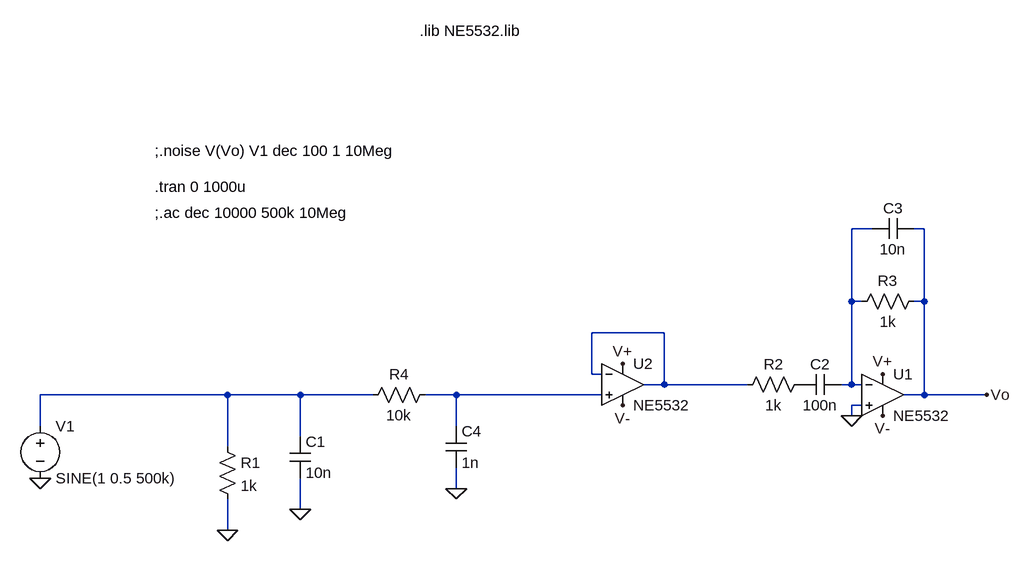
[diagram p0: schematic Draft1.asc]
Draft1.asc, the LTspice schematic file:
Version 4
SHEET 1 1004 680
WIRE 784 96 752 96
WIRE 864 96 848 96
WIRE 752 208 752 96
WIRE 768 208 752 208
WIRE 864 208 864 96
WIRE 864 208 848 208
WIRE 464 256 352 256
WIRE 352 320 352 256
WIRE 368 320 352 320
WIRE 464 336 464 256
WIRE 464 336 432 336
WIRE 592 336 464 336
WIRE 752 336 752 208
WIRE 752 336 736 336
WIRE 768 336 752 336
WIRE -208 352 -496 352
WIRE -96 352 -208 352
WIRE 16 352 -96 352
WIRE 144 352 96 352
WIRE 368 352 144 352
WIRE 864 352 864 208
WIRE 864 352 832 352
WIRE 960 352 864 352
WIRE 768 368 752 368
WIRE 752 384 752 368
WIRE -496 400 -496 352
WIRE 144 400 144 352
WIRE -96 416 -96 352
WIRE -208 432 -208 352
WIRE 144 496 144 464
WIRE -96 528 -96 480
WIRE -208 560 -208 512
FLAG -208 560 0
FLAG -96 528 0
FLAG 800 320 V+
FLAG 800 384 V-
FLAG 752 384 0
FLAG 400 304 V+
FLAG 400 368 V-
FLAG 144 496 0
FLAG -496 480 0
FLAG 960 352 Vo
SYMBOL Res -224 416 R0
SYMATTR InstName R1
SYMATTR Value 1k
SYMBOL Cap -112 416 R0
SYMATTR InstName C1
SYMATTR Value 10n
SYMBOL OpAmps/opamp2 800 288 R0
SYMATTR InstName U1
SYMATTR Value NE5532
SYMBOL Res 688 320 R90
WINDOW 0 0 56 VBottom 2
WINDOW 3 32 56 VTop 2
SYMATTR InstName R2
SYMATTR Value 1k
SYMBOL Cap 736 320 R90
WINDOW 0 0 32 VBottom 2
WINDOW 3 32 32 VTop 2
SYMATTR InstName C2
SYMATTR Value 100n
SYMBOL Res 864 192 R90
WINDOW 0 0 56 VBottom 2
WINDOW 3 32 56 VTop 2
SYMATTR InstName R3
SYMATTR Value 1k
SYMBOL OpAmps/opamp2 400 272 R0
SYMATTR InstName U2
SYMATTR Value NE5532
SYMBOL Cap 848 80 R90
WINDOW 0 0 32 VBottom 2
WINDOW 3 32 32 VTop 2
SYMATTR InstName C3
SYMATTR Value 10n
SYMBOL Res 112 336 R90
WINDOW 0 0 56 VBottom 2
WINDOW 3 32 56 VTop 2
SYMATTR InstName R4
SYMATTR Value 10k
SYMBOL Cap 128 400 R0
SYMATTR InstName C4
SYMATTR Value 1n
SYMBOL Voltage -496 384 R0
SYMATTR InstName V1
SYMATTR Value SINE(1 0.5 500k)
SYMATTR Value2 AC 1
TEXT 88 -208 Left 2 !.lib NE5532.lib
TEXT -320 32 Left 2 !.tran 0 1000u
TEXT -320 -24 Left 2 !;.noise V(Vo) V1 dec 100 1 10Meg
TEXT -320 72 Left 2 !;.ac dec 10000 500k 10Meg

The netlist it stands for:
* Draft1.asc
R1 N003 0 1k
C1 N003 0 10n
XU1 0 N001 V+ V- Vo NE5532  ; pins In+ In- V+ V- OUT
R2 P001 N002 1k
C2 N001 P001 100n
R3 Vo N001 1k
XU2 N004 N002 V+ V- N002 NE5532  ; pins In+ In- V+ V- OUT
C3 Vo N001 10n
R4 N004 N003 10k
C4 N004 0 1n
V1 N003 0 SINE(1 0.5 500k) AC 1
.lib NE5532.lib
.tran 0 1000u
;.noise V(Vo) V1 dec 100 1 10Meg
;.ac dec 10000 500k 10Meg
.backanno
.end